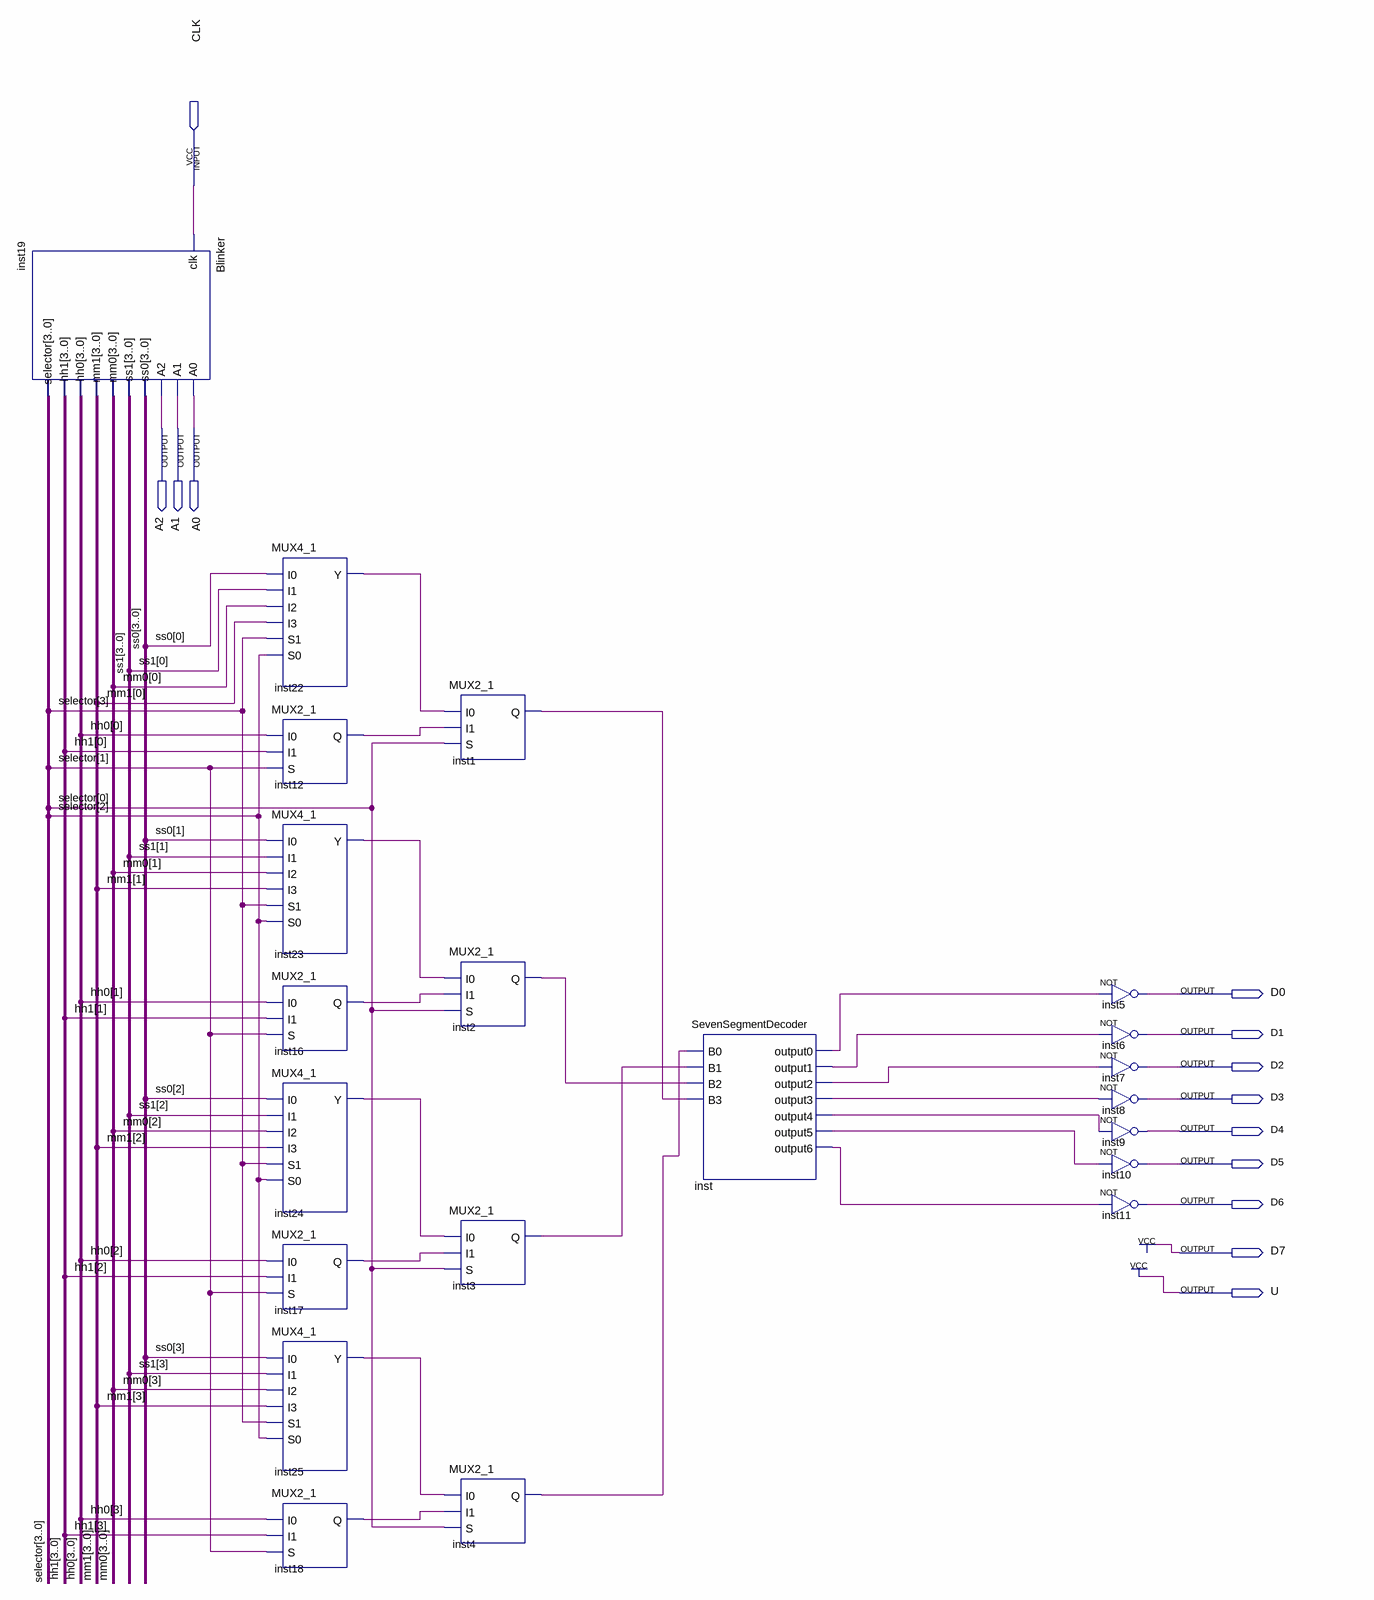
[diagram p0: schematic sheet]
// Quartus schematic SevenSegClock.bdf as structural Verilog: 21 symbols, 13 pins
module SevenSegClock (
  input  CLK,
  output A2,
  output A1,
  output A0,
  output D0,
  output D1,
  output D2,
  output D3,
  output D4,
  output D5,
  output D6,
  output D7,
  output U
);

  wire inst1_q, inst2_q, inst3_q, inst4_q, inst12_q, inst16_q, inst17_q, inst18_q, inst22_y, inst23_y,
       inst24_y, inst25_y, inst_output0, inst_output1, inst_output2, inst_output3, inst_output4,
       inst_output5, inst_output6;
  wire [3:0] hh0, hh1, mm0, mm1, selector, ss0, ss1;

  Blinker inst19 (
    .clk(CLK), .A0(A0), .A1(A1), .A2(A2), .ss0(ss0), .ss1(ss1), .mm0(mm0), .mm1(mm1), .hh0(hh0), .hh1(hh1),
    .selector(selector));
  MUX4_1 inst22 (.I0(ss0[0]), .I1(ss1[0]), .I2(mm0[0]), .I3(mm1[0]), .S1(selector[3]), .S0(selector[2]), .Y(inst22_y));
  MUX2_1 inst12 (.I0(hh0[0]), .I1(hh1[0]), .S(selector[1]), .Q(inst12_q));
  MUX4_1 inst23 (.I0(ss0[1]), .I1(ss1[1]), .I2(mm0[1]), .I3(mm1[1]), .S1(selector[3]), .S0(selector[2]), .Y(inst23_y));
  MUX2_1 inst16 (.I0(hh0[1]), .I1(hh1[1]), .S(selector[1]), .Q(inst16_q));
  MUX4_1 inst24 (.I0(ss0[2]), .I1(ss1[2]), .I2(mm0[2]), .I3(mm1[2]), .S1(selector[3]), .S0(selector[2]), .Y(inst24_y));
  MUX2_1 inst17 (.I0(hh0[2]), .I1(hh1[2]), .S(selector[1]), .Q(inst17_q));
  MUX4_1 inst25 (.I0(ss0[3]), .I1(ss1[3]), .I2(mm0[3]), .I3(mm1[3]), .S1(selector[3]), .S0(selector[2]), .Y(inst25_y));
  MUX2_1 inst18 (.I0(hh0[3]), .I1(hh1[3]), .S(selector[1]), .Q(inst18_q));
  MUX2_1 inst1 (.I0(inst22_y), .I1(inst12_q), .S(selector[0]), .Q(inst1_q));
  MUX2_1 inst2 (.I0(inst23_y), .I1(inst16_q), .S(selector[0]), .Q(inst2_q));
  MUX2_1 inst3 (.I0(inst24_y), .I1(inst17_q), .S(selector[0]), .Q(inst3_q));
  MUX2_1 inst4 (.I0(inst25_y), .I1(inst18_q), .S(selector[0]), .Q(inst4_q));
  SevenSegmentDecoder inst (
    .B0(inst4_q), .B1(inst3_q), .B2(inst2_q), .B3(inst1_q), .output0(inst_output0), .output1(inst_output1),
    .output2(inst_output2), .output3(inst_output3), .output4(inst_output4), .output5(inst_output5),
    .output6(inst_output6));
  not inst5 (D0, inst_output0);
  not inst6 (D1, inst_output1);
  not inst7 (D2, inst_output2);
  not inst8 (D3, inst_output3);
  not inst9 (D4, inst_output4);
  not inst10 (D5, inst_output5);
  not inst11 (D6, inst_output6);

  assign D7 = 1'b1;
  assign U = 1'b1;
endmodule
